# EAGLE schematic domino-can (EAGLE 6.5.0)
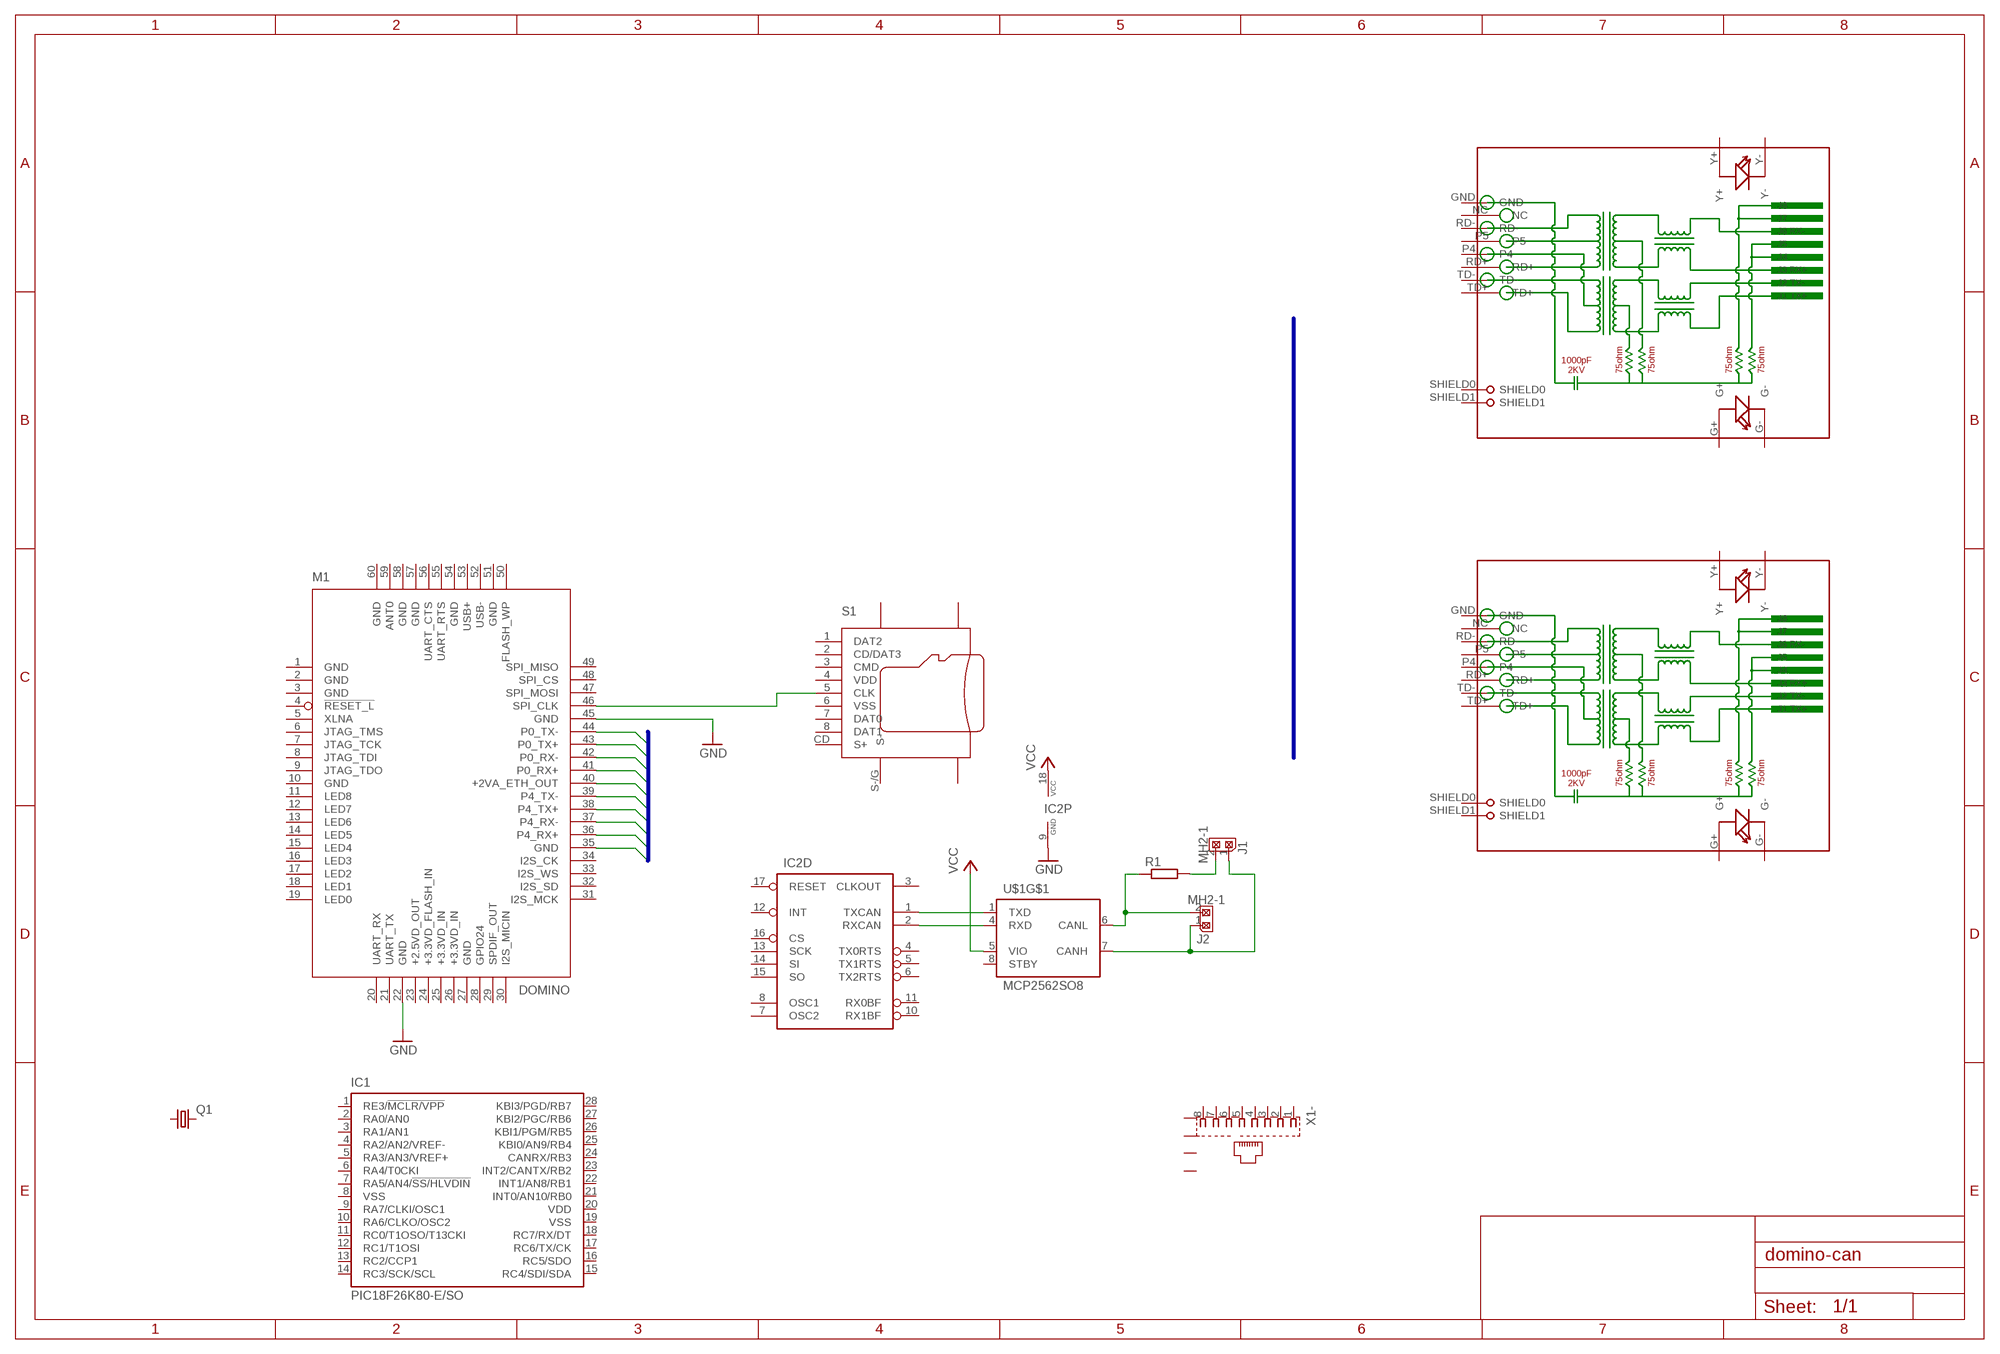
[diagram p0: schematic, sheet 1]

## Parts
IC1  PIC18F26K80-E/SO  [SO28W]
IC2  MCP2515SO  [SO-18W]
J1  MH2-1  [MH2-1-0.1]
J2  MH2-1  [MH2-1-0.1]
M1  DOMINO  [DOMINO]
Q1  CRYSTALHC49S  [HC49/S]
R1  R-EU_R1206  [R1206]
RJ1  HR911105A  [HR911105A]
RJ2  HR911105A  [HR911105A]
S1  MICRO-SD  [SD-007]
U$1  MCP2562SO8  [SO08]
X1  RJ45  [RJ45]

## Nets
+2VA_ETH_OUT: M1.40(+2VA_ETH_OUT)
GND: IC2.9(P:GND) M1.22(GND) M1.45(GND)
GND@10: M1.35(GND)
N$1: M1.46(SPI_CLK) S1.5(CLK)
N$2: M1.44(P0_TX-)
N$3: M1.43(P0_TX+)
N$4: M1.42(P0_RX-)
N$5: M1.41(P0_RX+)
N$6: M1.39(P4_TX-)
N$7: M1.38(P4_TX+)
N$8: M1.37(P4_RX-)
N$9: M1.36(P4_RX+)
N$10: IC2.1(D:TXCAN) U$1.1(TXD)
N$11: IC2.2(D:RXCAN) U$1.4(RXD)
N$12: J2.2 R1.1 U$1.6(CANL)
N$13: J1.1 J2.1 U$1.7(CANH)
N$14: J1.2 R1.2
VCC: IC2.18(P:VCC) U$1.5(VIO)
Unconnected: IC1.1(RE3/!MCLR/VPP) IC1.2(RA0/AN0) IC1.3(RA1/AN1) IC1.4(RA2/AN2/VREF-) IC1.5(RA3/AN3/VREF+) IC1.6(RA4/T0CKI) IC1.7(RA5/AN4/!SS/HLVDIN) IC1.9(RA7/CLKI/OSC1) IC1.10(RA6/CLKO/OSC2) IC1.11(RC0/T1OSO/T13CKI) IC1.12(RC1/T1OSI) IC1.13(RC2/CCP1) IC1.14(RC3/SCK/SCL) IC1.15(RC4/SDI/SDA) IC1.16(RC5/SDO) IC1.17(RC6/TX/CK) IC1.18(RC7/RX/DT) IC1.21(INT0/AN10/RB0) IC1.22(INT1/AN8/RB1) IC1.23(INT2/CANTX/RB2) IC1.24(CANRX/RB3) IC1.25(KBI0/AN9/RB4) IC1.26(KBI1/PGM/RB5) IC1.27(KBI2/PGC/RB6) IC1.28(KBI3/PGD/RB7) IC2.3(D:CLKOUT) IC2.4(D:TX0RTS) IC2.5(D:TX1RTS) IC2.6(D:TX2RTS) IC2.7(D:OSC2) IC2.8(D:OSC1) IC2.10(D:RX1BF) IC2.11(D:RX0BF) IC2.12(D:INT) IC2.13(D:SCK) IC2.14(D:SI) IC2.15(D:SO) IC2.16(D:CS) IC2.17(D:RESET) M1.4(!RESET_L) M1.5(XLNA) M1.6(JTAG_TMS) M1.7(JTAG_TCK) M1.8(JTAG_TDI) M1.9(JTAG_TDO) M1.11(LED8) M1.12(LED7) M1.13(LED6) M1.14(LED5) M1.15(LED4) M1.16(LED3) M1.17(LED2) M1.18(LED1) M1.19(LED0) M1.20(UART_RX) M1.21(UART_TX) M1.23(+2.5VD_OUT) M1.28(GPIO24) M1.29(SPDIF_OUT) M1.30(I2S_MICIN) M1.31(I2S_MCK) M1.32(I2S_SD) M1.33(I2S_WS) M1.34(I2S_CK) M1.47(SPI_MOSI) M1.48(SPI_CS) M1.49(SPI_MISO) M1.50(FLASH_WP) M1.52(USB-) M1.53(USB+) M1.55(UART_RTS) M1.56(UART_CTS) M1.59(ANT0) Q1.1 Q1.2 RJ1.G+ RJ1.G- RJ1.GND RJ1.NC RJ1.P4 RJ1.P5 RJ1.RD+ RJ1.RD- RJ1.SHIELD0 RJ1.SHIELD1 RJ1.TD+ RJ1.TD- RJ1.Y+ RJ1.Y- RJ2.G+ RJ2.G- RJ2.GND RJ2.NC RJ2.P4 RJ2.P5 RJ2.RD+ RJ2.RD- RJ2.SHIELD0 RJ2.SHIELD1 RJ2.TD+ RJ2.TD- RJ2.Y+ RJ2.Y- S1.1(DAT2) S1.2(CD/DAT3) S1.3(CMD) S1.7(DAT0) S1.8(DAT1) S1.CD(S+) U$1.8(STBY) X1.1 X1.2 X1.3 X1.4 X1.5 X1.6 X1.7 X1.8 X1.G1 X1.G2 X1.G3 X1.G4

## Buses
ETHERNET

## Power pins joined to a net without a drawn wire
+3.3VD_FLASH_IN: M1.24(+3.3VD_FLASH_IN)
+3.3VD_IN: M1.25(+3.3VD_IN) M1.26(+3.3VD_IN)
G: S1.G$1(G) S1.G$2(G) S1.G$3(G)
GND: M1.1(GND) M1.2(GND) M1.3(GND) M1.10(GND) M1.27(GND) M1.51(GND) M1.54(GND) M1.57(GND) M1.58(GND) M1.60(GND) U$1.2(GND)
S-: S1.S-/G(S-)
VCC: U$1.3(VCC)
VDD: IC1.20(VDD) S1.4(VDD)
VSS: IC1.8(VSS) IC1.19(VSS) S1.6(VSS)

## Library data of the parts
IC1 = PIC18F26K80:PIC18F26K80: 28-Pin Enhanced Flash Microcontrollers with ECAN(TM) Technology 10-Bit A/D and nanoWatt Technology Source: http://www.microchip.com .. 39637a.pdf
IC2 = can:MCP2515: MC2515 Stand-Alone CAN Controller With SPI Interface, Microchip
J1 J2 = Domino:MH2-1: 2x1 Pin Male Header
M1 = Domino:DOMINO: GL-Connect Domino WiFi Module
Q1 = adafruit:CRYSTAL: CRYSTAL; OC_FARNELL: 1667008; OC_NEWARK: unknown
R1 = rcl:R-EU_: RESISTOR, European symbol
RJ1 RJ2 = CONNECTER:HR911105A
S1 = Domino:MICRO-SD: Micro SD Memory Card Connector, With Card Detect Switch
U$1 = can:MCP2562: CAN Tranceiver Microchip
X1 = con-appsys:RJ45: AMP connector